# EAGLE design emonPlug v1-1 (EAGLE 9.6.2)

## Sheet 1 of 2
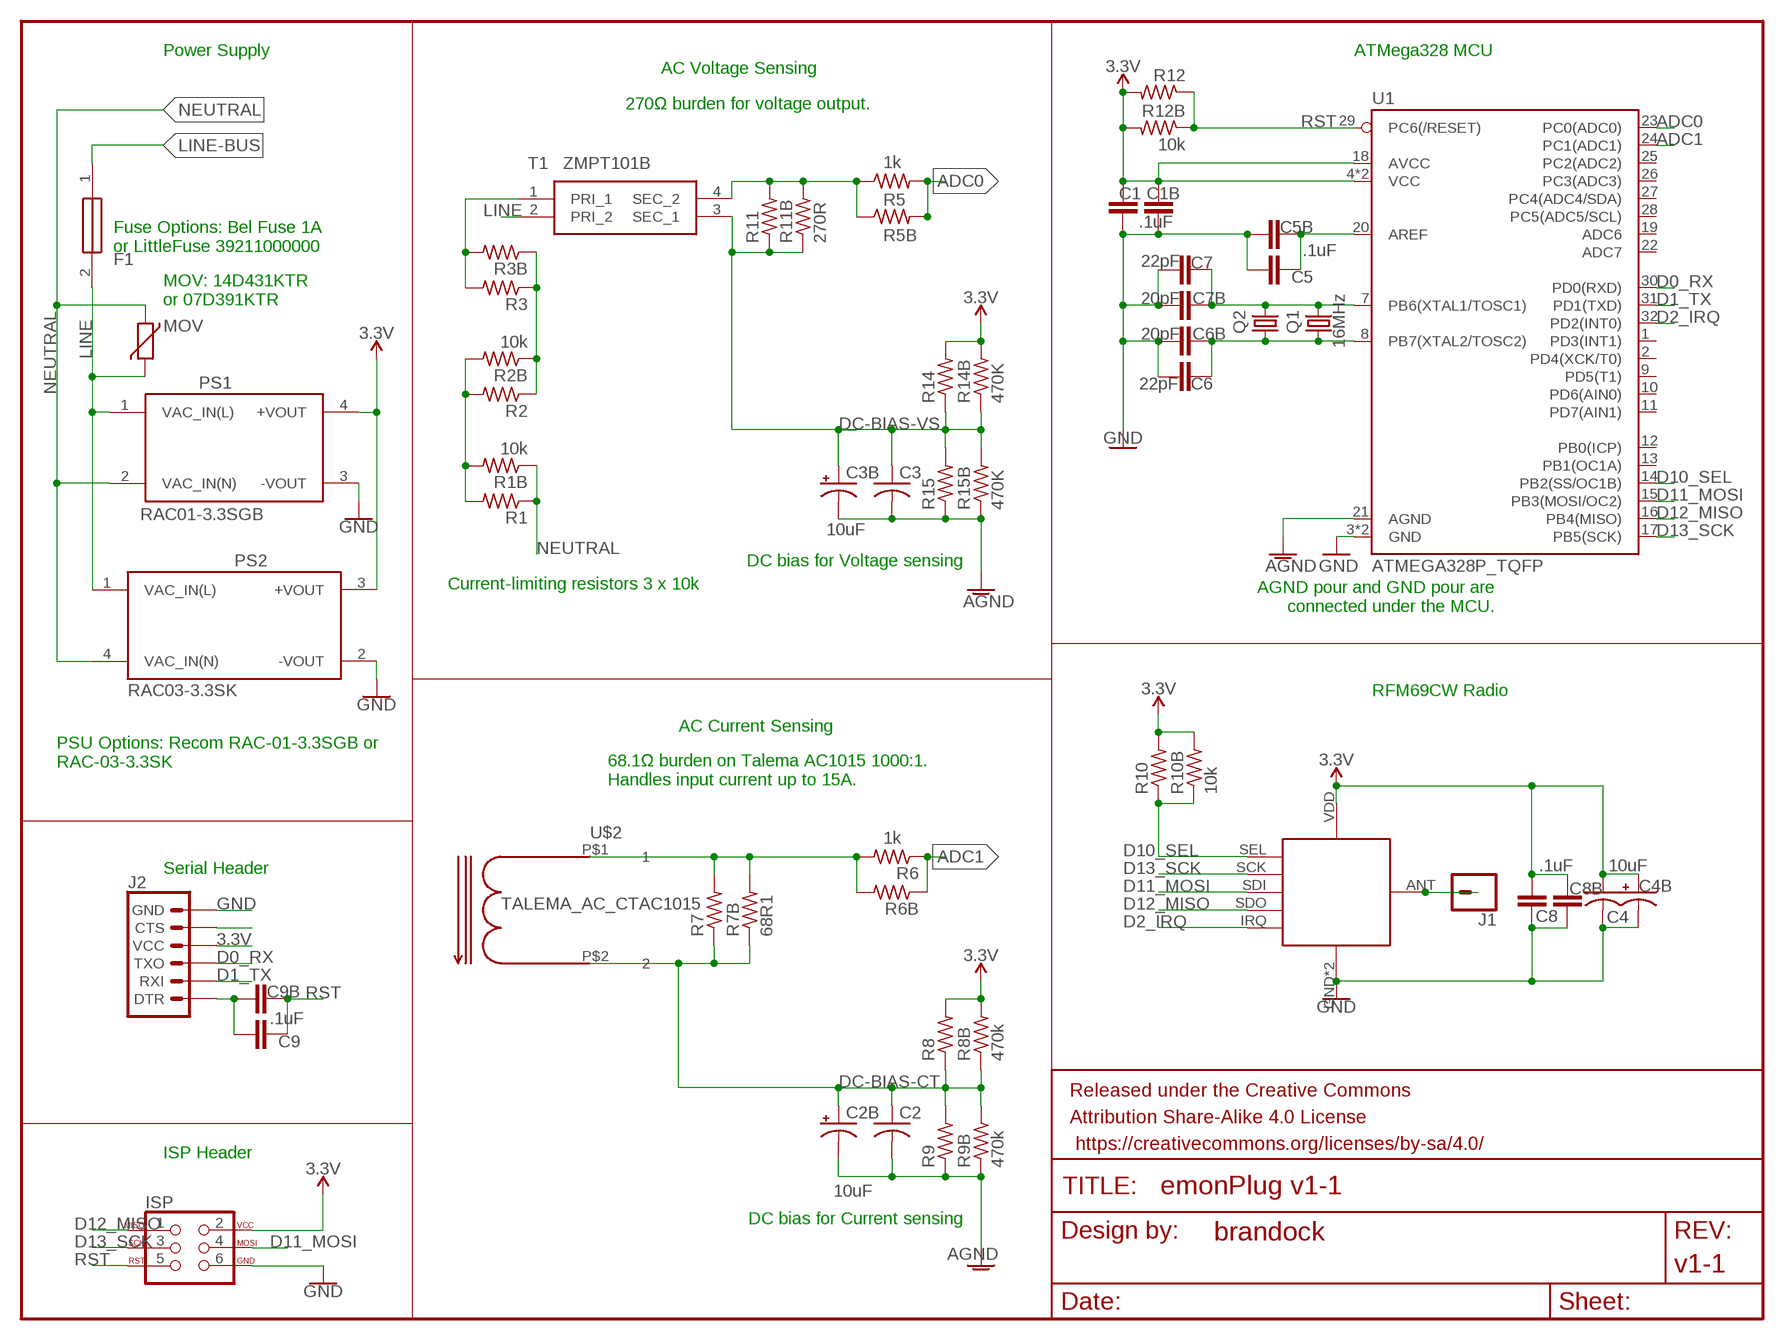
[diagram p0: schematic, sheet 1]

### Parts
C1  .1uF  C-EUC0805  [C0805]
C1B  .1uF  C-EU025-024X044  [C025-024X044]
C2  C-USC0805  [C0805]
C2B  10uF  CPOL-USE1.8-4  [E1,8-4]
C3  C-USC0805  [C0805]
C3B  10uF  CPOL-USE1.8-4  [E1,8-4]
C4  10uF  C-USC0805  [C0805]
C4B  10uF  CPOL-USE1.8-4  [E1,8-4]
C5  .1uF  C-EUC0805  [C0805]
C5B  .1uF  C-EU025-024X044  [C025-024X044]
C6  22pF  C-EUC0805  [C0805]
C6B  20pF  C-EU025-024X044  [C025-024X044]
C7  22pF  C-EUC0805  [C0805]
C7B  20pF  C-EU025-024X044  [C025-024X044]
C8  .1uF  C-EUC0805  [C0805]
C8B  .1uF  C-EU025-024X044  [C025-024X044]
C9  .1uF  C-EUC0805  [C0805]
C9B  .1uF  C-EU025-024X044  [C025-024X044]
F1  39211000000  [39211000000]
FRAME1  FRAME-LETTER  [CREATIVE_COMMONS]
ISP  AVR_SPI_PROG_3X22X3_LOCK  [2X3_LOCK]
J1  CONN_01  [1X01]
J2  6_PIN_SERIAL_TARGET_SILK  [1X06]
MOV  VARISTOR-5  [R-5]
PS1  RAC01-3.3SGB  [CONV_RAC01-3.3SGB]
PS2  RAC03-3.3SK  [CONV_RAC03-3.3SK]
Q1  16MHz  CRYSTALHC49S-NOSILK  [HC49/S-NO-SILK]
Q2  CRYSTALHC49UP  [HC49UP]
R1  R-US_R0805  [R0805]
R1B  10k  R-US_0204/7  [0204/7]
R2  R-US_R0805  [R0805]
R2B  10k  R-US_0204/7  [0204/7]
R3  R-US_R0805  [R0805]
R3B  R-US_0204/7  [0204/7]
R5  1k  R-US_R0805  [R0805]
R5B  R-US_0204/7  [0204/7]
R6  R-US_R0805  [R0805]
R6B  1k  R-US_0204/7  [0204/7]
R7  R-US_R0805  [R0805]
R7B  68R1  R-US_0204/7  [0204/7]
R8  R-US_R0805  [R0805]
R8B  470k  R-US_0204/7  [0204/7]
R9  R-US_R0805  [R0805]
R9B  470k  R-US_0204/7  [0204/7]
R10  R-US_R0805  [R0805]
R10B  10k  R-US_0204/7  [0204/7]
R11  R-US_R0805  [R0805]
R11B  270R  R-US_0204/7  [0204/7]
R12  R-US_R0805  [R0805]
R12B  10k  R-US_0204/7  [0204/7]
R14  R-US_R0805  [R0805]
R14B  470K  R-US_0204/7  [0204/7]
R15  R-US_R0805  [R0805]
R15B  470K  R-US_0204/7  [0204/7]
T1  ZMPT101B  [ZMPT101B]
U1  ATMEGA328P_TQFP  [TQFP32-08]
U$2  TALEMA_AC_CTAC1015  [AC1005-1020]
U$3  RFM12B_MINPADS  [RFM12B-MINPADS]

### Nets
3.3V: C1.2 C1B.1 C4.1 C4B.+ C8.1 C8B.1 ISP.2 J2.4(VCC) PS1.4(+VOUT) PS2.3(+VOUT) R8.2 R8B.2 R10.2 R10B.2 R12.2 R12B.2 R14.2 R14B.2 U1.4(VCC) U1.6(VCC) U1.18(AVCC) U$3.VDD
ADC0: R5.2 R5B.2 U1.23(PC0(ADC0))
ADC1: R6.1 R6B.1 U1.24(PC1(ADC1))
AGND: C2.2 C2B.- C3.2 C3B.- R9.1 R9B.1 R15.1 R15B.1 U1.21(AGND)
D0_RX: J2.3(TXO) U1.30(PD0(RXD))
D1_TX: J2.2(RXI) U1.31(PD1(TXD))
D2_IRQ: U1.32(PD2(INT0)) U$3.IRQ
D10_SEL: R10.1 R10B.1 U1.14(PB2(SS/OC1B)) U$3.SEL
D11_MOSI: ISP.4 U1.15(PB3(MOSI/OC2)) U$3.SDI(SDI/MOSI)
D12_MISO: ISP.1 U1.16(PB4(MISO)) U$3.SDO(SDO/MISO)
D13_SCK: ISP.3 U1.17(PB5(SCK)) U$3.SCK
DC-BIAS-CT: C2.1 C2B.+ R7.1 R7B.1 R8.1 R8B.1 R9.2 R9B.2 U$2.P$2
DC-BIAS-VS: C3.1 C3B.+ R11.1 R11B.1 R14.1 R14B.1 R15.2 R15B.2 T1.3(SEC_1)
GND: C1.1 C1B.2 C4.2 C4B.- C5.1 C5B.1 C6.2 C6B.2 C7.2 C7B.2 C8.2 C8B.2 ISP.6 J2.6(GND) PS1.3(-VOUT) PS2.2(-VOUT) U1.3(GND) U1.5(GND) U$3.GND U$3.GND2(GND)
LINE [AC-power]: F1.2 MOV.1 PS1.1(VAC_IN(L)) PS2.1(VAC_IN(L)) T1.2(PRI_2)
LINE-BUS: F1.1
N$1: R6.2 R6B.2 R7.2 R7B.2 U$2.P$1
N$2: R3.2 R3B.2 T1.1(PRI_1)
N$3: C7.1 C7B.1 Q1.2 Q2.2 U1.7(PB6(XTAL1/TOSC1))
N$4: C6.1 C6B.1 Q1.1 Q2.1 U1.8(PB7(XTAL2/TOSC2))
N$5: C9.1 C9B.1 J2.1(DTR)
N$6: J1.1 U$3.ANT
N$7: R1.2 R1B.2 R2.2 R2B.2
N$8: R5.1 R5B.1 R11.2 R11B.2 T1.4(SEC_2)
N$9: R2.1 R2B.1 R3.1 R3B.1
N$10: J2.5(CTS)
N$17: C5.2 C5B.2 U1.20(AREF)
NEUTRAL [AC-power]: MOV.2 PS1.2(VAC_IN(N)) PS2.4(VAC_IN(N)) R1.1 R1B.1
RST: C9.2 C9B.2 ISP.5 R12.1 R12B.1 U1.29(PC6(/RESET))
Unconnected: U1.1(PD3(INT1)) U1.2(PD4(XCK/T0)) U1.9(PD5(T1)) U1.10(PD6(AIN0)) U1.11(PD7(AIN1)) U1.12(PB0(ICP)) U1.13(PB1(OC1A)) U1.19(ADC6) U1.22(ADC7) U1.25(PC2(ADC2)) U1.26(PC3(ADC3)) U1.27(PC4(ADC4/SDA)) U1.28(PC5(ADC5/SCL))

### Notes on the sheet
- Power Supply | ATMega328 MCU
- AC Voltage Sensing
- 270Ω burden for voltage output.
- Fuse Options: Bel Fuse 1A
  or LittleFuse 39211000000
- MOV: 14D431KTR
  or 07D391KTR
- DC bias for Voltage sensing
- AGND pour and GND pour are
  connected under the MCU.
- Current-limiting resistors 3 x 10k
- RFM69CW Radio
- AC Current Sensing
- PSU Options: Recom RAC-01-3.3SGB or
  RAC-03-3.3SK
- 68.1Ω burden on Talema AC1015 1000:1. 
  Handles input current up to 15A.
- Serial Header
- ISP Header
- DC bias for Current sensing

## Sheet 2 of 2

## Library data of the parts
C1 C5-C9 = rcl-emonOutlet:C-EU: CAPACITOR, European symbol; SPICEPREFIX: C
C1B C5B C6B C7B C8B C9B = rcl:C-EU: CAPACITOR, European symbol; SPICEPREFIX: C
C2-C4 = rcl-emonOutlet:C-US: CAPACITOR, American symbol; SPICEPREFIX: C
C2B C3B C4B = rcl:CPOL-US: POLARIZED CAPACITOR, American symbol; SPICEPREFIX: C
F1 = Fuse 39211000000:39211000000: Fuses with Leads (Through Hole) 250V IEC TL LL 1A TE5 Source: Datasheet <https://datasheet.lcsc.com/szlcsc/Littelfuse-39211000000_C99566.pdf>; DESCRIPTION: Fuses with Leads (Through Hole) 250V IEC TL LL 1A TE5; HEIGHT: 8mm; MANUFACTURER_NAME: LITTELFUSE; MANUFACTURER_PART_NUMBER: 39211000000; MOUSER_PART_NUMBER: 576-3921100000; MOUSER_PRICE-STOCK: https://www.mouser.co.uk/ProductDetail/Littelfuse/39211000000?qs=x71drwq5GondAmkqFlpf6Q%3D%3D
FRAME1 = SparkFun-Aesthetics:FRAME-LETTER: Schematic Frame - Letter Standard 8.5x11 US Letter frame; DESIGNER: brandock; REV: v1-1
ISP = SparkFun-Connectors:AVR_SPI_PROG_3X2: AVR ISP 6 Pin This is the reduced ISP connector for AVR programming. Common on Arduino. This footprint will take up less PCB space and can be used with a 10-pin to 6-pin adapter such as SKU: BOB-08508 **Special note about "TEST_POINT" package. The stop mask is on the top side, so if you want your programming test points to be on the bottom of your board, make sure to place this package on the bottom side of the board. This also ensure that the orientation to program from the bottom side will be correct. SparkFun Products: SparkFun ISP Pogo Adapter <https://www.sparkfun.com/products/11591> - NS Tiny AVR Programmer <https://www.sparkfun.com/products/11801> -PTH
J1 = SparkFun-Connectors:CONN_01: Single connection point. Often used as Generic Header-pin footprint for 0.1 inch spaced/style header connections On any of the 0.1 inch spaced packages, you can populate with these: Break Away Headers - Straight <https://www.sparkfun.com/products/116> (PRT-00116) Break Away Male Headers - Right Angle <https://www.sparkfun.com/products/553> (PRT-00553) Female Headers <https://www.sparkfun.com/products/115> (PRT-00115) Break Away Headers - Machine Pin <https://www.sparkfun.com/products/117> (PRT-00117) Break Away Female Headers - Swiss Machine Pin <https://www.sparkfun.com/products/743> (PRT-00743) This device is also useful as a general connection point to wire up your design to another part of your project. Our various solder wires solder well into these plated through hole pads. Hook-Up Wire - Assortment (Stranded, 22 AWG) <https://www.sparkfun.com/products/11375> (PRT-11375) Hook-Up Wire - Assortment (Solid Core, 22 AWG) <https://www.sparkfun.com/products/11367> (PRT-11367) View the entire wire category on our website here <https://www.sparkfun.com/categories/141> Special notes: SMTSO-256-ET is a "flush mount" nut for a 4-40 screw. We mostly use this on specialty testbeds; it is a nice way to connect hardware to your PCB at an adjustable hieght. Also note, the SNAP packages are for using a snappable style connector. We sell a baggie of snaps and they are also used on two LilyPad designs: Snap Assortment - 30 pack (male and female) <https://www.sparkfun.com/products/11347> (DEV-11347) LilyPad Arduino SimpleSnap <https://www.sparkfun.com/products/10941> (DEV-10941) LilyPad SimpleSnap Protoboard <https://www.sparkfun.com/products/10940> (DEV-10940)
J2 = SparkFun-Connectors:6_PIN_SERIAL_TARGET: 6-pin header connection for use with the "FTDI BASIC" pinout - TARGET SIDE. Also known as "Arduino Serial Program Header". It is used to mate with our FTDI Basic serial programmers using the Arduino IDE. Note, this device has "TARGET" in the name. It is intended to be used on a design that contains a target micro-controller that you wish to program. The "sister" device, named "CABLE" is inteneded to be used on a design that usually lives on the end of your USB cable and prvides the converter chip (FTDI232 or FTDI231x) to commnicate serial RX/TX. You can populate with some of these: Break Away Headers - Straight <https://www.sparkfun.com/products/116> (PRT-00116) For reference (or to suit your programming needs) check out these designs: SparkFun FTDI Basic Breakout - 5V <https://www.sparkfun.com/products/9716> (DEV-09716) SparkFun FTDI Basic Breakout - 3.3V <https://www.sparkfun.com/products/9873> (DEV-09873) SparkFun FTDI SmartBasic <https://www.sparkfun.com/products/12935> (DEV-12935) SparkFun Beefy 3 - FTDI Basic Breakout <https://www.sparkfun.com/products/13746> (DEV-13746)
MOV = Circuit Protection MOV:VARISTOR: VARISTOR
PS1 = RAC01-3.3SGB:RAC01-3.3SGB: AC/DC Converter, 1 Watt, Single Output, EMC Class B Check availability <https://pricing.snapeda.com/parts/RAC01-3.3SGB/Recom%20Power/view-part?ref=eda>; AVAILABILITY: In Stock; DESCRIPTION: 1W AC/DC-Converter 'POWERLINE' 3kV reg; MF: Recom Power; MP: RAC01-3.3SGB; PACKAGE: DIP-4 Recom Power; PRICE: None; PURCHASE-URL: https://pricing.snapeda.com/search/part/RAC01-3.3SGB/?ref=eda
PS2 = RAC03-3.3SK:RAC03-3.3SK: 3W AC/DC-Converter 'POWERLINE' 3kV reg Check availability <https://pricing.snapeda.com/parts/RAC03-3.3SK/Recom%20Power/view-part?ref=eda>; AVAILABILITY: In Stock; DESCRIPTION: Enclosed AC DC Converters 1 Uitgang 3.3V - - - 900mA 85 ~ 264 VAC, 120 ~ 370 VDC Input; MF: Recom Power; MP: RAC03-3.3SK; PACKAGE: None; PRICE: None; PURCHASE-URL: https://pricing.snapeda.com/search/part/RAC03-3.3SK/?ref=eda
Q1 = crystal-HC49S-No-Silk:CRYSTAL: CRYSTAL
Q2 = crystal:CRYSTAL: CRYSTAL; OC_FARNELL: unknown; OC_NEWARK: unknown
R1-R3 R5-R12 R14 R15 = rcl:R-US_: RESISTOR, American symbol; SPICEPREFIX: R
R1B R2B R3B R5B R6B R7B R8B R9B R10B R11B R12B R14B R15B = rcl-emonOutlet:R-US_: RESISTOR, American symbol; SPICEPREFIX: R
T1 = ZMPT101B:ZMPT101B: Current-type Voltage Transformer Source: Datasheet; DESCRIPTION: Current-type Voltage Transformer; HEIGHT: 18.8mm; MANUFACTURER_NAME: Qingxian Zeming Langxi Electronic; MANUFACTURER_PART_NUMBER: ZMPT101B
U1 = SparkFun-IC-Microcontroller:ATMEGA328P_TQFP: Popular 328P in QFP Storefront component: ATmega328 - TQFP <https://www.sparkfun.com/products/13448> (COM-13448) Datasheet <http://www.sparkfun.com/datasheets/Components/SMD/ATMega328.pdf> SparkFun Products SparkFun RedBoard - Programmed with Arduino <https://www.sparkfun.com/products/12757> (DEV-12757) Arduino Pro Mini 328 - 5V/16MHz <https://www.sparkfun.com/products/11113> (DEV-11113) Arduino Pro Mini 328 - 3.3V/8MHz <https://www.sparkfun.com/products/11114> (DEV-11114) SparkFun OpenLog <https://www.sparkfun.com/products/13712> (DEV-13712) SparkFun MicroView - OLED Arduino Module <https://www.sparkfun.com/products/12923> (DEV-12923) SparkFun Digital Sandbox <https://www.sparkfun.com/products/12651> (DEV-12651) SparkFun PicoBoard <https://www.sparkfun.com/products/11888> (WIG-11888) Arduino Fio <https://www.sparkfun.com/products/10116> (DEV-10116) LilyPad Arduino 328 Main Board <https://www.sparkfun.com/products/13342> (DEV-13342) SparkFun RedStick <https://www.sparkfun.com/products/13741> (DEV-13741) LilyPad MP3 <https://www.sparkfun.com/products/11013> (DEV-11013) LilyPad Arduino SimpleSnap <https://www.sparkfun.com/products/10941> (DEV-10941) SparkFun Stepoko <https://www.sparkfun.com/products/13899> (ROB-13899) SparkFun Geiger Counter <https://www.sparkfun.com/products/11345> (SEN-11345) SparkFun EL Sequencer <https://www.sparkfun.com/products/12781> (COM-12781) Arduino Pro 328 - 5V/16MHz <https://www.sparkfun.com/products/10915> (DEV-10915) CryptoCape <https://www.sparkfun.com/products/12773> (DEV-12773) SparkFun IR Thermometer Evaluation Board - MLX90614 <https://www.sparkfun.com/products/10740> (SEN-10740) SparkFun RedBot Mainboard <https://www.sparkfun.com/products/12097> (ROB-12097) Arduino Pro 328 - 3.3V/8MHz <https://www.sparkfun.com/products/10914> (DEV-10914) SparkFun Block for Intel® Edison - Arduino <https://www.sparkfun.com/products/13036> (DEV-13036) SparkFun Simon Says - Surface Mount Soldering Kit <https://www.sparkfun.com/products/10935> (KIT-10935) SparkFun 7-Segment Serial Display - Red <https://www.sparkfun.com/products/11441> (COM-11441) SparkFun 7-Segment Serial Display - White <https://www.sparkfun.com/products/11629> (COM-11629) SparkFun 7-Segment Serial Display - Yellow <https://www.sparkfun.com/products/11443> (COM-11443) SparkFun 7-Segment Serial Display - Kelly Green <https://www.sparkfun.com/products/11440> (COM-11440) SparkFun 7-Segment Serial Display - Blue <https://www.sparkfun.com/products/11442> (COM-11442) SparkFun OpenSegment Serial Display - 20mm (Blue) <https://www.sparkfun.com/products/11647> (COM-11647) SparkFun OpenSegment Serial Display - 20mm (Green) <https://www.sparkfun.com/products/11646> (COM-11646) SparkFun OpenSegment Serial Display - 20mm (White) <https://www.sparkfun.com/products/11648> (COM-11648) SparkFun OpenSegment Serial Display - 20mm (Red) <https://www.sparkfun.com/products/11644> (COM-11644) SparkFun OpenSegment Serial Display - 20mm (Yellow) <https://www.sparkfun.com/products/11645> (COM-11645) SparkFun OpenSegment Shield <https://www.sparkfun.com/products/13190> (DEV-13190); PROD_ID: IC-09069
U$2 = Current Transformers:TALEMA_AC_CT: https://talema.com/wp-content/uploads/datasheets/AC.pdf Digikey 1295-1097-ND
U$3 = RFM_MiniPads:RFM12B_MINPADS

## Board
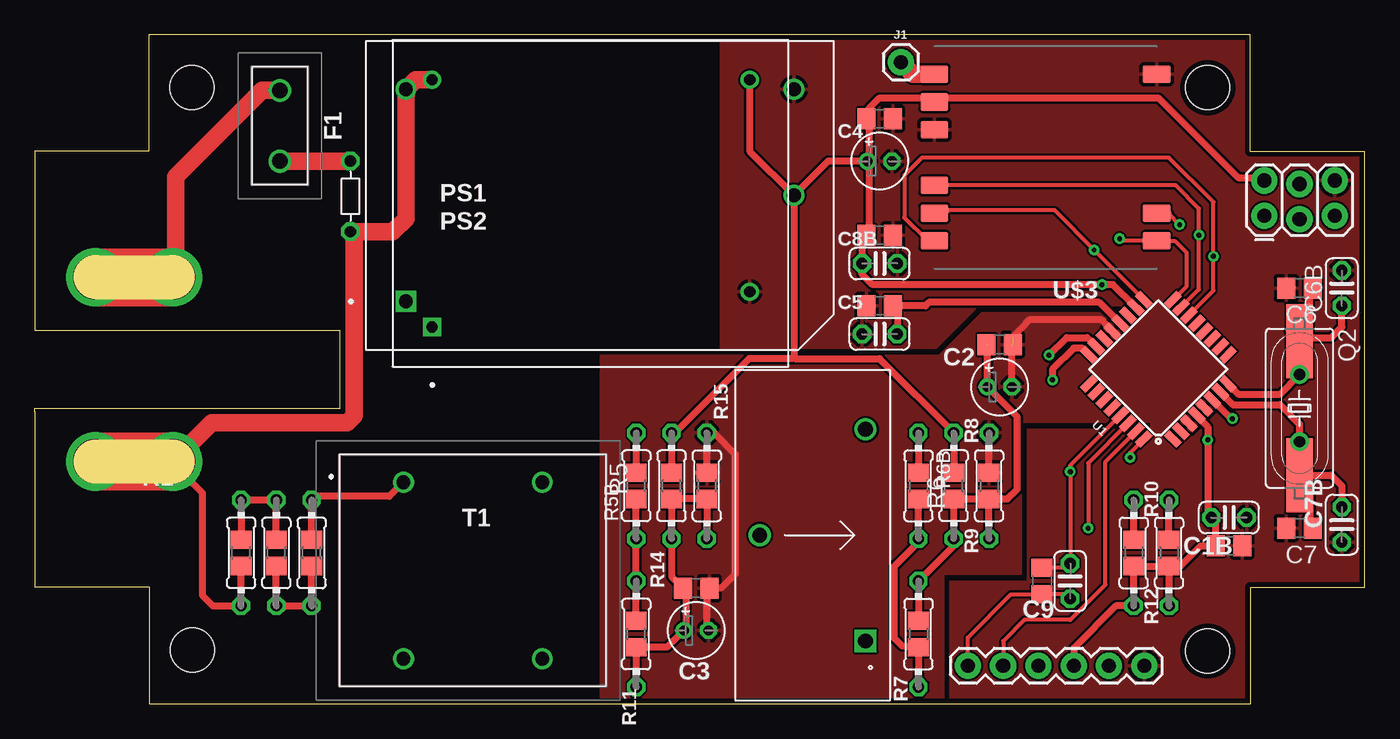
[diagram p1: board, top side]
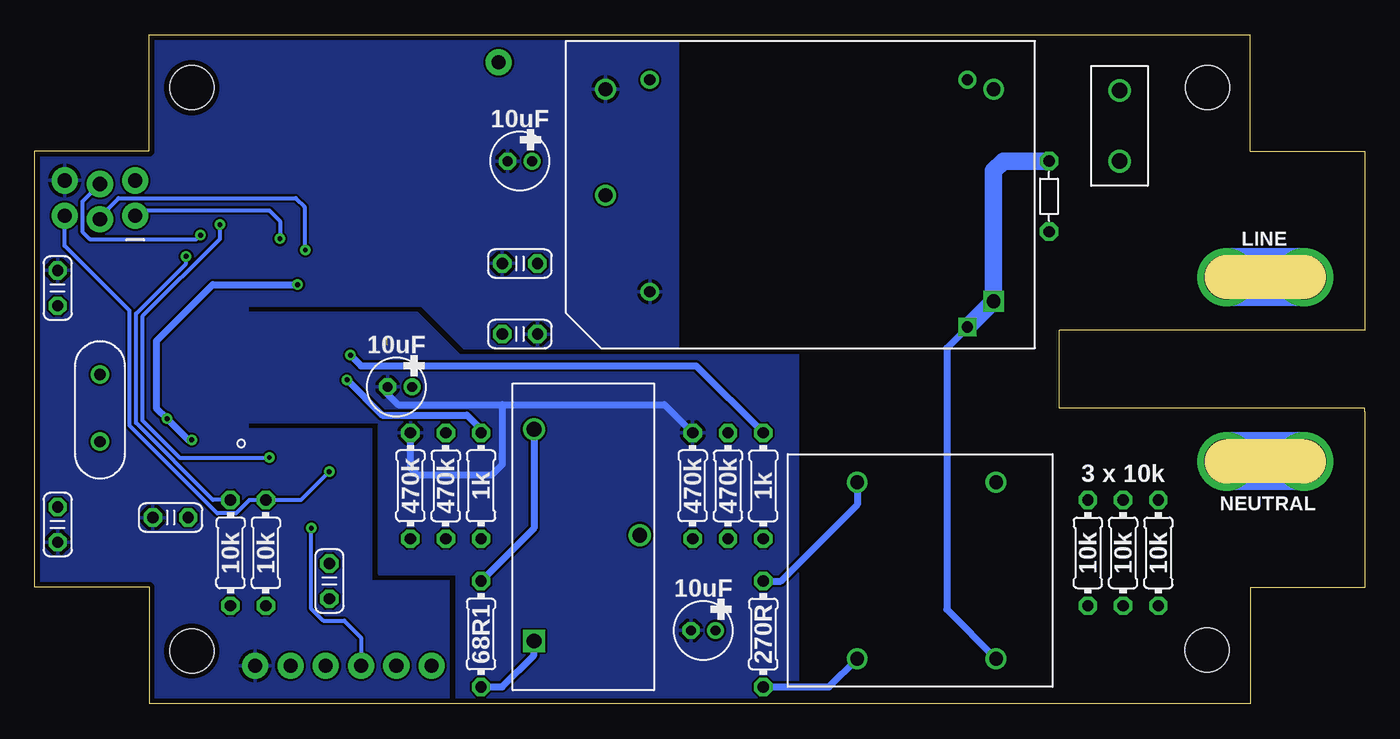
[diagram p2: board, bottom side, seen from below]

Size 95.76 x 48.16 mm. Coordinates in mm from the lower left corner, seen from the top.
Outline: 8.23,8.38 0,8.38 0,21.03 0,21.29 21.97,21.29 21.97,26.87 0,26.87 0,27.13 0,39.78 8.23,39.78 8.23,48.16 87.53,48.16 87.53,39.78 95.76,39.78 95.76,8.38 87.53,8.38 87.53,0 8.23,0 8.23,8.38
Copper layers (1*16): Top 0.035mm / dielectric 1.5mm / Bottom 0.035mm
Design rules "default *": minimum track width 6mil, minimum drill 0.35mm, track to track 6mil, track to pad 6mil, pad to pad 6mil, via to via 6mil, smd to smd 6mil, copper to edge 15mil, drill to drill 6mil, minimum pad ring 10mil, minimum via ring 8mil, stop-mask expansion 4mil, vias tented up to drill 0mil, thermal gap 10mil
Holes 3.17 mm at 11.35,3.86 84.45,3.81 84.45,44.35 11.3,44.35
Milling: 2 lines

### Footprints (pad centres in the part's own frame; a part is rotated, then mirrored left to right if it is on the bottom)
C0805 = smd 1.3 x 1.5: 1 -0.95,0; 2 0.95,0
C025-024X044 = drill 0.813 octagon: 1 -1.27,0; 2 1.27,0
E1,8-4 = drill 0.711 pad 1.168: + -0.889,0 | drill 0.711 pad 1.168 octagon: - 0.889,0
39211000000 = drill 1.1 pad 1.65: 1 0,0; 2 5.08,0
2X3_LOCK = drill 1.016 pad 1.88: 1 0,0.127; 2 0,2.667; 3 2.54,-0.127; 4 2.54,2.413; 5 5.08,0.127; 6 5.08,2.667
1X01 = drill 1.016 pad 1.88: 1 0,0
1X06 = drill 1.016 pad 1.88: 1 0,0; 2 2.54,0; 3 5.08,0; 4 7.62,0; 5 10.16,0; 6 12.7,0
R-5 = drill 0.813 octagon: 1 -2.54,0; 2 2.54,0
CONV_RAC01-3.3SGB = drill 1 pad 1.5 square: 1 -13.97,-7.62 | drill 1 pad 1.5: 2 -13.97,7.62; 3 13.97,7.62; 4 13.97,0
CONV_RAC03-3.3SK = drill 0.8 pad 1.2 square: 1 -8.89,11.39 | drill 0.8 pad 1.2: 2 -6.35,-11.47; 3 8.89,-11.47; 4 8.89,11.39
HC49/S-NO-SILK = drill 0.813: 1 -2.413,0; 2 2.413,0
HC49UP = smd 5.334 x 1.93: 1 -4.826,0; 2 4.826,0
R0805 = smd 1.3 x 1.5: 1 -0.95,0; 2 0.95,0
0204/7 = drill 0.813 octagon: 1 -3.81,0; 2 3.81,0
ZMPT101B = drill 1 pad 1.5: 1 0,0; 2 0,-12.7; 3 10,-12.7; 4 10,0
TQFP32-08 = smd 1.27 x 0.559: 1 -4.293,2.8; 2 -4.293,2; 3 -4.293,1.2; 4 -4.293,0.4; 5 -4.293,-0.4; 6 -4.293,-1.2; 7 -4.293,-2; 8 -4.293,-2.8; 17 4.293,-2.8; 18 4.293,-2; 19 4.293,-1.2; 20 4.293,-0.4; 21 4.293,0.4; 22 4.293,1.2; 23 4.293,2; 24 4.293,2.8 | smd 0.559 x 1.27: 9 -2.8,-4.293; 10 -2,-4.293; 11 -1.2,-4.293; 12 -0.4,-4.293; 13 0.4,-4.293; 14 1.2,-4.293; 15 2,-4.293; 16 2.8,-4.293; 25 2.8,4.293; 26 2,4.293; 27 1.2,4.293; 28 0.4,4.293; 29 -0.4,4.293; 30 -1.2,4.293; 31 -2,4.293; 32 -2.8,4.293
AC1005-1020 = drill 1.063 square: P$1 7.62,3.81 | drill 1.063: P$2 -7.62,3.81; P$3 0,-3.81
RFM12B-MINPADS = smd 2 x 1.27: ANT 8,-6; GND 8,-2; GND2 -8.002,-6.001; IRQ -8,4; SCK 8,4; SDI 8,2; SDO -8,6; SEL 8,6; VDD 8,-4

### Placement (x,y rotation side)
C1  85.98,11.38 180 top
C1B  85.98,13.41 0 top
C2  69.47,25.86 0 top
C2B  69.47,22.81 0 top
C3  47.62,8.33 0 top
C3B  47.62,5.28 0 top
C4  60.83,42.11 0 top
C4B  60.83,39.07 0 top
C5  60.83,28.65 0 top
C5B  60.83,26.62 0 top
C6  91.06,29.92 180 top
C6B  94.11,29.92 90 top
C7  91.06,12.65 180 top
C7B  94.11,12.9 270 top
C8  60.83,33.73 0 top
C8B  60.83,31.7 0 top
C9  72.52,8.84 90 top
C9B  74.55,8.84 90 top
F1  17.65,44.15 270 top
FRAME1  -3.94,-1.19 90 top  (outside the outline)
ISP  88.52,35 0 top
J1  62.36,46.18 0 top
J2  67.18,2.74 0 top
MOV  22.73,36.53 270 top
PS1  40.69,36.6 0 top
PS2  40,36.02 90 top
Q1  91.06,21.29 270 top
Q2  91.06,21.29 270 top
R1  14.86,10.87 90 top
R1B  14.86,10.87 90 top
R2  17.4,10.87 90 top
R2B  17.4,10.87 90 top
R3  19.94,10.87 90 top
R3B  19.94,10.87 90 top
R5  43.31,15.7 90 top
R5B  43.31,15.7 90 top
R6  63.63,15.7 270 top
R6B  63.63,15.7 270 top
R7  63.63,5.03 270 top
R7B  63.63,5.03 270 top
R8  66.17,15.7 90 top
R8B  66.17,15.7 90 top
R9  68.71,15.7 270 top
R9B  68.71,15.7 270 top
R10  81.66,10.87 270 top
R10B  81.66,10.87 270 top
R11  43.31,5.03 90 top
R11B  43.31,5.03 90 top
R12  79.12,10.87 270 top
R12B  79.12,10.87 270 top
R14  45.85,15.7 90 top
R14B  45.85,15.7 90 top
R15  48.39,15.7 270 top
R15B  48.39,15.7 270 top
T1  26.54,15.95 0 top
U1  80.9,24.08 135 top
U$2  56.01,12.14 270 top
U$3  72.77,39.32 180 top

### Tracks (layer width: path | path; a pad name or v marks a point on that pad's centre or on a via)
3.3V  (via drill 0.35)
  Top 0.508: U1.18 77.63,30.18 v76.84,30.18 60.32,30.18 59.56,30.94 C8B.1 59.56,33.22 59.88,33.54 C8.1 60.07,33.92 60.07,38.94 | U1.6 86.15,20.52 v86.23,20.52 | U1.4 84.45,19.96 v84.45,19 84.45,13.67 C1B.1 85.03,13.09 C1.2 83.95,11.38 82.49,9.92 R10.2 | ISP.2 88.32,37.87 86.64,37.87 80.94,43.57 65.03,43.57 U$3.VDD 64.52,43.57 60.77,43.57 60.07,42.88 60.07,42.2 C4.1 60.07,42.03 60.07,39.19 | C4B.+ 57.12,39.07 PS1.4 | C4B.+ 60.07,39.19 | 60.07,39.19 60.07,38.94 | R8.2 R8B.2 60.83,24.84 54.74,24.84 54.66,24.92 | R14.2 R14B.2 46.1,19.51 51.43,24.84 54.58,24.84 54.66,24.92 | PS2.3 51.47,39.79 PS1.4 | J2.4 74.8,4.01 77.85,7.06 R12B.2 R12.2 R10.2 | C4B.+ 60.08,38.92 | PS1.4 54.66,24.92 | R10.2 R10B.2 | C4B.+ 60.07,38.94
  Bottom 0.508: v76.84,30.18 82.93,30.18 87,26.11 87,21.29 v86.23,20.52 84.71,19 v84.45,19
ADC0  (via drill 0.35)
  Top 0.508: v73.03,25.1 74.3,26.37 75.79,26.37 U1.23 | R5B.2 R5.2
  Bottom 0.508: R5B.2 48.13,24.33 72.26,24.33 v73.03,25.1
ADC1  (via drill 0.35)
  Top 0.508: U1.24 75.42,25.6 74.8,25.6 73.28,24.08 v73.28,23.32 | R6B.1 R6.1
  Bottom 0.508: v73.28,23.32 70.74,20.78 64.64,20.78 63.63,19.76 R6B.1
AGND  (2 unrouted)
  Top 0.508: U1.21 76.82,27.64 71.6,27.64 70.42,26.39 | C3.2 48.37,8.23 48.37,5.42 C3B.- | C3.2 48.39,8.33 | C2B.- 70.36,25.82 | R15.1 R15B.1 48.89,19.51 50.42,17.98 50.42,9.35 49.4,8.33 C3.2 | R9.1 R9B.1
  Bottom 0.508: C2B.- 70.36,22.3 69.6,21.54 62.1,21.54 | R15B.1 50.42,21.54 62.1,21.54 | 62.1,21.54 62.1,17.22 62.87,16.46 68.2,16.46 68.71,16.97 R9B.1
  pour Top: 40.77,-0.81 40.77,25.1 65.15,25.1 68.2,28.14 81.41,28.14 81.41,20.27 70.99,20.27 70.99,9.35 65.41,9.35 65.41,-0.81
  pour Bottom: 40.77,-0.81 40.77,25.1 65.15,25.1 68.2,28.14 81.41,28.14 81.41,20.27 70.99,20.27 70.99,9.35 65.41,9.35 65.41,-0.81
D0_RX  (via drill 0.35)
  Top 0.305: U1.30 75.84,17.33 v75.84,12.65
  Bottom 0.305: J2.3 72.26,4.78 73.48,5.99 74.99,5.99 75.84,6.85 v75.84,12.65
D1_TX
  Top 0.305: U1.31 77.09,17.44 77.09,8.59 74.55,6.05 71.25,6.05 69.72,4.52 J2.2
D2_IRQ  (via drill 0.35)
  Top 0.305: U1.32 78.87,18.09 v78.87,17.73 | 81.6,35.32 v82.42,34.49
  Top 0.508: U$3.IRQ 81.6,35.32
  Bottom 0.305: v82.42,34.49 82.42,33.48 88.01,27.89 88.01,20.41 85.33,17.73 v78.87,17.73
D10_SEL  (via drill 0.35)
  Top 0.305: 64.29,33.32 62.61,35 62.61,38.05 63.88,39.32 81.66,39.32 84.86,36.12 v84.86,32.21 84.86,29.74 U1.14
  Top 0.508: U$3.SEL 64.29,33.32 | R10.1 R10B.1
  Bottom 0.305: R10B.1 82.93,14.68 88.47,20.22 88.47,28.08 84.86,31.69 v84.86,32.21
D11_MOSI  (via drill 0.35)
  Top 0.305: U1.15 83.82,29.83 v83.82,33.73 83.82,35.64 82.14,37.32 U$3.SDI
  Bottom 0.152: 84.1,33.45 v83.82,33.73
  Bottom 0.305: ISP.4 92.33,36.14 92.33,33.99 91.8,33.45 84.1,33.45
D12_MISO  (via drill 0.35)
  Top 0.305: U1.16 82.93,30.07 82.93,32.46 82.07,33.32 U$3.SDO 78.26,33.32 v78.11,33.48
  Bottom 0.305: ISP.1 88.14,35.51 78.87,35.51 78.11,34.75 v78.11,33.48
D13_SCK  (via drill 0.35)
  Top 0.305: U1.17 v76.28,32.66 73.43,35.51 65.66,35.51
  Top 0.508: U$3.SCK 64.96,35.51 65.66,35.51
  Bottom 0.152: 76.33,32.72 v76.28,32.66 | v76.28,32.66
  Bottom 0.305: 91.06,35.05 89.71,36.4 76.96,36.4 76.33,35.76 76.33,32.72
  Bottom 0.508: ISP.3 91.06,35.05
DC-BIAS-CT  (1 unrouted)
  Top 0.508: R7.1 R7B.1 66.17,11.38 R8B.1 R8.1 R9.2 | 68.58,25.82 C2B.+ 70.74,20.65 70.74,15.44 70.04,14.75 R9.2 | R9B.2 R9.2
  Bottom 0.508: U$2.P$2 59.82,12.65 R7B.1
DC-BIAS-VS
  Top 0.508: R15B.2 R15.2 R14.1 | R14.1 R14B.1 45.85,9.16 C3.1 | 46.86,8.84 46.86,8.42 C3.1 | C3.1 46.88,8.23 46.88,5.42 C3B.+ 45.53,4.08 R11.1 | R11.1 R11B.1 | R14.1 45.68,14.68 | R11.1 43.22,4.27
  Bottom 0.508: R11B.1 38.57,1.22 T1.3
GND
  pour Top: 65.91,-0.81 65.91,8.84 71.5,8.84 71.5,19.76 80.39,19.76 80.39,28.65 67.95,28.65 64.9,25.6 49.4,25.6 49.4,48.46 96.39,48.46 96.39,-0.81
  pour Bottom: 65.91,-0.81 65.91,8.84 71.5,8.84 71.5,19.76 80.39,19.76 80.39,28.65 67.95,28.65 64.9,25.6 49.4,25.6 49.4,48.46 96.39,48.46 96.39,-0.81
LINE
  Top 1.27: F1.2 MOV.1
  Bottom 0.508: PS2.1 28.61,27.09 30.1,25.6 30.1,6.81 T1.2
  Bottom 1.27: MOV.1 26.04,39.07 26.72,38.38 PS1.1 28.57,27.13 PS2.1
LINE-BUS  (via drill 3.17)
  Top 1.27: 9.2,31.47 v9.96,30.71 10.16,30.91 10.16,37.92 16.38,44.15 F1.1
  Top 4.191: v4.37,30.71 v9.96,30.71
  Bottom 4.191: v4.37,30.71 v9.96,30.71
N$1
  Top 0.508: R7B.2 R7.2 62.45,4.18 61.85,4.78 61.85,9.86 63.63,11.63 R6B.2 R6.2
  Bottom 0.508: R7B.2 62.1,1.22 59.82,3.51 U$2.P$1
N$2
  Top 0.508: R3.2 R3B.2 20.19,14.94 25.53,14.94 T1.1
N$3
  Top 0.305: Q2.2 Q1.2
  Top 0.508: U1.7 86.23,21.57 86.23,21.54 89.66,21.54 91.06,20.14 Q1.2 | 90.55,15.95 Q2.2 | Q2.2 93.34,16.46 94.11,15.7 C7B.1 | C7.1 91.82,12.84 91.82,15.7 Q2.2
N$4
  Top 0.305: Q2.1 Q1.1
  Top 0.508: U1.8 86.64,22.3 89.66,22.3 Q1.1 | 90.3,26.87 Q2.1 | Q2.1 91.31,26.37 93.34,26.37 94.11,27.13 C6B.1 | Q2.1 91.78,26.83 91.78,29.69 C6.1
N$5
  Top 0.305: J2.1 67.18,4.78 70.3,7.89 C9.1 74.23,7.89 C9B.1
N$6
  Top 1.27: J1.1 63.21,45.32 U$3.ANT
N$7
  Top 0.152: 17.4,14.63 R2B.2 | 14.86,14.63 R1B.2
  Top 0.508: 14.86,14.63 R1.2 | R2.2 R2B.2 R1B.2
N$8
  Top 0.508: R11.2 R11B.2 R5B.1 R5.1
  Bottom 0.508: T1.4 36.54,14.33 42.04,8.84 R11B.2
N$9
  Top 0.152: R2.1 17.5,9.75 17.4,9.65 | 17.4,7.01 R2B.1 | 19.94,7.01 R3B.1
  Top 0.508: R3.1 R3B.1 R2B.1 17.4,9.65
N$17
  Top 0.508: U1.20 76.64,28.91 64.39,28.91 64.14,28.65 C5.2 62.1,28.23 C5B.2
NEUTRAL  (via drill 3.17)
  Top 0.508: R1.1 R1B.1 12.83,7.06 12.06,7.82 12.06,15.19 9.96,17.3 v9.96,17.45
  Top 1.27: PS2.4 27.41,44.91 PS1.2 26.72,34.93 25.78,33.99 MOV.2 22.99,33.73 22.99,20.75 22.48,20.24 12.75,20.24 v9.96,17.45
  Top 4.191: v4.37,17.45 v9.96,17.45
  Bottom 4.191: v4.37,17.45 v9.96,17.45
RST  (via drill 0.35)
  Top 0.305: U1.29 74.55,17.16 v74.55,16.71 C9B.2 74.23,9.79 C9.2
  Top 0.508: R12.1 R12B.1
  Bottom 0.305: ISP.5 93.6,32.97 88.92,28.3 88.92,20.03 82.61,13.72 81.26,13.72 80.3,14.68 R12B.1 76.58,14.68 v74.55,16.71

### Text on the board
bPlace: 10uF | LINE | 10uF | 3 x 10k | 1k | 470k | 470k | 1k | 470k | 470k | NEUTRAL | 10k | 10k | 10k | 10k | 10k | 10uF | 270R | 68R1
tValues: ANT | v1-1 | ANT | VCC | FUSE | GND | RFM69CW/ / RFM12B | LINE | ISP | EARTH | ATMEGA328 | NEUTRAL | 10k x2 | AC1015 | 10k x3 | FTDI | DTR | 3V3 | GND
bValues: emonPlug / Brandon Baldock / github.com/brandock